# EAGLE design ser2can (EAGLE 6.5.0)
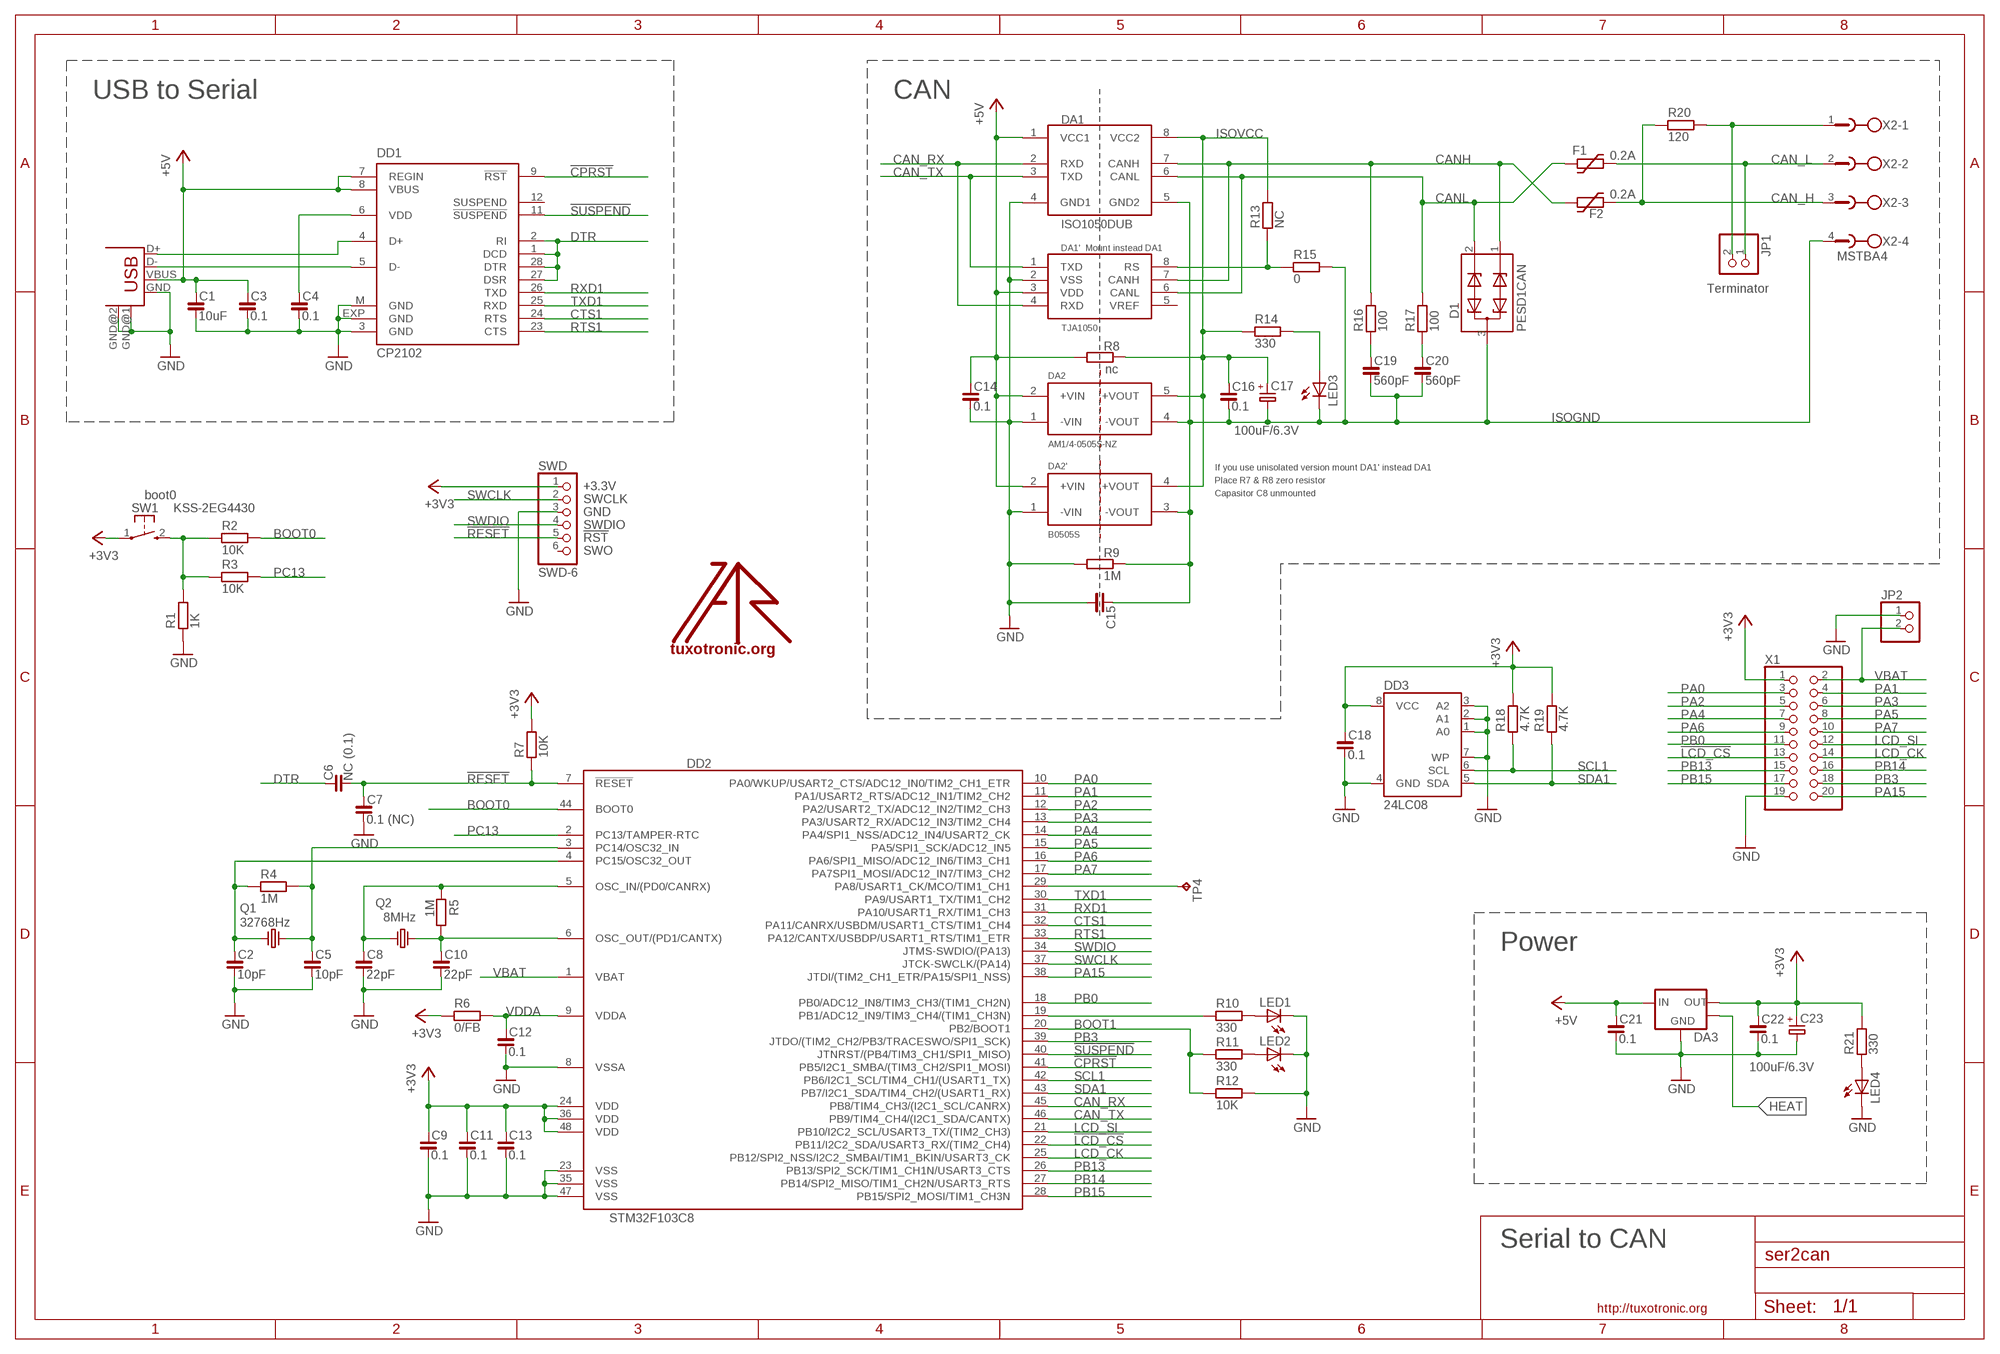
[diagram p0: schematic, sheet 1]

## Parts
C1  10uF  C_0603  [C0603]
C2  10pF  C_0603  [C0603]
C3  0.1  C_0603  [C0603]
C4  0.1  C_0603  [C0603]
C5  10pF  C_0603  [C0603]
C6  NC (0.1)  C_0603  [C0603]
C7  0.1 (NC)  C_0603  [C0603]
C8  22pF  C_0603  [C0603]
C9  0.1  C_0603  [C0603]
C10  22pF  C_0603  [C0603]
C11  0.1  C_0603  [C0603]
C12  0.1  C_0603  [C0603]
C13  0.1  C_0603  [C0603]
C14  0.1  C_0603  [C0603]
C15  C_C050-110X055  [C050-110X055]
C16  0.1  C_0603  [C0603]
C17  100uF/6.3V  CP_SMCC  [SMC_C]
C18  0.1  C_0603  [C0603]
C19  560pF  C_0603  [C0603]
C20  560pF  C_0603  [C0603]
C21  0.1  C_0805  [C0805]
C22  0.1  C_0805  [C0805]
C23  100uF/6.3V  CP_SMCC  [SMC_C]
D1  PESD1CAN  [SOT23]
DA1  ISO1050DUB  [DUB-8]
DA1'  TJA1050  [SO08]
DA2  AM1/4-0505S-NZ  [AM1/4]
DA2'  B0505S  VA-S1  [SIP4]
DA3  LM1117-3.3  [SOT223]
DD1  CP2102  [MLP28]
DD2  STM32F103C8  [LQFP48]
DD3  24LC08  AT24C256S  [SO08]
F1  0.2A  1812L  [1812L]
F2  0.2A  1812L  [1812L]
JP1  PINHD-1X2_2.54S  [1X02SMALL]
JP2  PINHD-1X2_2.00  [1X02M]
LED1  LEDCHIPLED_0805  [CHIPLED_0805]
LED2  LEDCHIPLED_0805  [CHIPLED_0805]
LED3  LEDCHIPLED_0805  [CHIPLED_0805]
LED4  LEDCHIPLED_0805  [CHIPLED_0805]
Q1  32768Hz  CRYSTAL-MM20SS  [MM20SS]
Q2  8MHz  CRYSTAL-HC49S  [HC49/S]
R1  1K  R_0603  [R0603]
R2  10K  R_0603  [R0603]
R3  10K  R_0603  [R0603]
R4  1M  R_0603  [R0603]
R5  1M  R_0603  [R0603]
R6  0/FB  R_0603  [R0603]
R7  10K  R_0603  [R0603]
R8  nc  R_1206  [R1206]
R9  1M  R_1206  [R1206]
R10  330  R_0603  [R0603]
R11  330  R_0603  [R0603]
R12  10K  R_0603  [R0603]
R13  NC  R_0603  [R0603]
R14  330  R_0603  [R0603]
R15  0  R_0603  [R0603]
R16  100  R_0603  [R0603]
R17  100  R_0603  [R0603]
R18  4.7K  R_0603  [R0603]
R19  4.7K  R_0603  [R0603]
R20  120  R_0805  [R0805]
R21  330  R_0603  [R0603]
SW1  KSS-2EG4430  [KSS-2EG4430]
SWD  SWD-6  [JTAG6PIN]
TP4  TPB1,27  [B1,27]
U$  LOGO  [TT_LOGO]
USB1  USB-B-H  [USB-B-H]
X1  PINHD-2X10_2.54  [2X10]
X2  MSTBA4  [MSTBA4]

## Nets
!CPRST: DD1.9(!RST) DD2.41(PB5/I2C1_SMBA/(TIM3_CH2/SPI1_MOSI))
!LCD_CS: DD2.22(PB11/I2C2_SDA/USART3_RX/(TIM2_CH4)) X1.13
!RESET: C6.2 C7.1 DD2.7(!RESET) R7.1 SWD.5
!SUSPEND: DD1.11(!SUSPEND) DD2.40(JTNRST/(PB4/TIM3_CH1/SPI1_MISO))
+3V3: C9.1 C11.1 C13.1 C18.1 C22.1 C23.+ DA3.2(OUT) DD2.24(VDD) DD2.36(VDD) DD2.48(VDD) DD3.8(VCC) R6.1 R7.2 R18.2 R19.2 R21.2 SW1.1(P) SWD.1 X1.1
+5V: C1.1 C3.1 C14.1 C21.1 DA1'.3(VDD) DA1.1(VCC1) DA2'.2(+VIN) DA2.2(+VIN) DA3.3(IN) DD1.7(REGIN) DD1.8(VBUS) R8.1 USB1.VBUS
BOOT0: DD2.44(BOOT0) R2.2
BOOT1: DD2.20(PB2/BOOT1) R11.1 R12.1
CAN_H: F2.P$2 R20.1 X2.3
CAN_L: F1.P$2 JP1.1 X2.2
CAN_L_R: JP1.2 R20.2 X2.1
CAN_RX: DA1'.4(RXD) DA1.2(RXD) DD2.45(PB8/TIM4_CH3/(I2C1_SCL/CANRX))
CAN_TX: DA1'.1(TXD) DA1.3(TXD) DD2.46(PB9/TIM4_CH4/(I2C1_SDA/CANTX))
CANH: D1.1 DA1'.7(CANH) DA1.7(CANH) F2.P$1 R16.2
CANL: D1.2 DA1'.6(CANL) DA1.6(CANL) F1.P$1 R17.2
CTS1: DD1.24(RTS) DD2.32(PA11/CANRX/USBDM/USART1_CTS/TIM1_CH4)
DTR: C6.1 DD1.1(DCD) DD1.2(RI) DD1.27(DSR) DD1.28(DTR)
GND: C1.2 C2.2 C3.2 C4.2 C5.2 C7.2 C8.2 C9.2 C10.2 C11.2 C12.2 C13.2 C14.2 C15.2 C18.2 C21.2 C22.2 C23.- DA1'.2(VSS) DA1.4(GND1) DA2'.1(-VIN) DA2.1(-VIN) DA3.1(GND) DD1.3(GND) DD1.EXP(GND) DD1.M(GND) DD2.8(VSSA) DD2.23(VSS) DD2.35(VSS) DD2.47(VSS) DD3.1(A0) DD3.2(A1) DD3.3(A2) DD3.4(GND) DD3.7(WP) JP2.1 LED1.C LED2.C LED4.C R1.1 R9.1 R12.2 SWD.3 USB1.GND USB1.GND@1(GND) USB1.GND@2(GND) X1.19
HEAT: DA3.4(MASS)
ISOGND: C15.1 C16.2 C17.- C19.2 C20.2 D1.3 DA1.5(GND2) DA2'.3(-VOUT) DA2.4(-VOUT) LED3.C R9.2 R15.2 X2.4
ISOVCC: C16.1 C17.+ DA1.8(VCC2) DA2'.4(+VOUT) DA2.5(+VOUT) R8.2 R13.2 R14.1
LCD_CK: DD2.25(PB12/SPI2_NSS/I2C2_SMBAI/TIM1_BKIN/USART3_CK) X1.14
LCD_SI: DD2.21(PB10/I2C2_SCL/USART3_TX/(TIM2_CH3)) X1.12
N$2: R1.2 R2.1 R3.1 SW1.2(S)
N$3: DD2.29(PA8/USART1_CK/MCO/TIM1_CH1) TP4.PP(TP)
N$4: LED2.A R11.2
N$5: LED1.A R10.2
N$6: LED3.A R14.2
N$7: DD1.5(D-) USB1.D-
N$8: DD1.4(D+) USB1.D+
N$9: LED4.A R21.1
N$10: DD2.19(PB1/ADC12_IN9/TIM3_CH4/(TIM1_CH3N)) R10.1
N$15: DA1'.8(RS) R13.1 R15.1
N$16: C4.1 DD1.6(VDD)
N$54: C20.1 R17.1
N$55: C19.1 R16.1
OSC_IN: C8.1 DD2.5(OSC_IN/(PD0/CANRX)) Q2.1 R5.1
OSC_IN1: C5.1 DD2.3(PC14/OSC32_IN) Q1.4 R4.2
OSC_OUT: C10.1 DD2.6(OSC_OUT/(PD1/CANTX)) Q2.2 R5.2
OSC_OUT1: C2.1 DD2.4(PC15/OSC32_OUT) Q1.1 R4.1
PA0: DD2.10(PA0/WKUP/USART2_CTS/ADC12_IN0/TIM2_CH1_ETR) X1.3
PA1: DD2.11(PA1/USART2_RTS/ADC12_IN1/TIM2_CH2) X1.4
PA2: DD2.12(PA2/USART2_TX/ADC12_IN2/TIM2_CH3) X1.5
PA3: DD2.13(PA3/USART2_RX/ADC12_IN3/TIM2_CH4) X1.6
PA4: DD2.14(PA4/SPI1_NSS/ADC12_IN4/USART2_CK) X1.7
PA5: DD2.15(PA5/SPI1_SCK/ADC12_IN5) X1.8
PA6: DD2.16(PA6/SPI1_MISO/ADC12_IN6/TIM3_CH1) X1.9
PA7: DD2.17(PA7SPI1_MOSI/ADC12_IN7/TIM3_CH2) X1.10
PA15: DD2.38(JTDI/(TIM2_CH1_ETR/PA15/SPI1_NSS)) X1.20
PB0: DD2.18(PB0/ADC12_IN8/TIM3_CH3/(TIM1_CH2N)) X1.11
PB3: DD2.39(JTDO/(TIM2_CH2/PB3/TRACESWO/SPI1_SCK)) X1.18
PB13: DD2.26(PB13/SPI2_SCK/TIM1_CH1N/USART3_CTS) X1.15
PB14: DD2.27(PB14/SPI2_MISO/TIM1_CH2N/USART3_RTS) X1.16
PB15: DD2.28(PB15/SPI2_MOSI/TIM1_CH3N) X1.17
PC13: DD2.2(PC13/TAMPER-RTC) R3.2
RTS1: DD1.23(CTS) DD2.33(PA12/CANTX/USBDP/USART1_RTS/TIM1_ETR)
RXD1: DD1.26(TXD) DD2.31(PA10/USART1_RX/TIM1_CH3)
SCL1: DD2.42(PB6/I2C1_SCL/TIM4_CH1/(USART1_TX)) DD3.6(SCL) R18.1
SDA1: DD2.43(PB7/I2C1_SDA/TIM4_CH2/(USART1_RX)) DD3.5(SDA) R19.1
SWCLK: DD2.37(JTCK-SWCLK/(PA14)) SWD.2
SWDIO: DD2.34(JTMS-SWDIO/(PA13)) SWD.4
TXD1: DD1.25(RXD) DD2.30(PA9/USART1_TX/TIM1_CH2)
VBAT: DD2.1(VBAT) JP2.2 X1.2
VDDA: C12.1 DD2.9(VDDA) R6.2
Unconnected: DA1'.5(VREF) DD1.12(SUSPEND) SWD.6

## Notes on the sheet
- USB to Serial | CAN
- Mount instead DA1
- Terminator
- If you use unisolated version mount DA1' instead DA1
- Place R7 & R8 zero resistor
- boot0 | Capasitor C8 unmounted
- Power
- Serial to CAN

## Library data of the parts
C1-C14 C16 C18-C22 = rc-master-smd:C_: NON-POLARIZED CAP
C15 = rc-master:C_: NON-POLARIZED CAP
C17 C23 = rc-master-smd:CP_: POLARIZED CAP
D1 = protect:PESD1CAN: Features Due to the integrated diode structure only one small SOT23 package is needed to protect two CAN bus lines Max. peak pulse power: PPP = 200 W at tp = 8/20 ?s Low clamping voltage: VCL = 40 V at IPP = 1 A Ultra low leakage current: IRM < 1 nA ESD protection up to 23 kV IEC 61000-4-2, level 4 (ESD) IEC 61000-4-5 (surge); IPP = 3 A at tp = 8/20 ?s Small SMD plastic package Applications CAN bus protection Automotive applications
DA1 = can_driver:ISO1050: ISOLATED CAN TRANSCEIVER
DA1' = can_driver:TJA1050: High speed CAN transceiver Input levels compatible with 3.3 V and 5 V devices 5V supply
DA2 = dcdc-isolated:AM1/4-: AIMTEC: Series AM1/4L-NZ 1/4 Watt | DC-DC Converter RoHS Compliant SMD Package Low ripple and noise High efficiency up to 68% Operating temperature -40oC to + 85oC Input/Output Isolation 1000 and 3000VDC Pin compatible with multiple manufacturers UL94-VO Package
DA2' = dcdc-isolated:VA-****: MOTIEN_DC/DC Single Output Power Converters
DA3 = vreg-linear:LM1117: Linear regulators
DD1 = cp210x-uart:CP210*: Single-Chip USB to UART Bridge Source: www.silabs.com .. CP2101.pdf / cp2102.pdf
DD2 = stm32:STM32F103C
DD3 = stm32-by-pb:AT24C*: 2-wire serial EEPROM
F1 F2 = discrete:1812L
JP1 JP2 = pinhead-fixdrills:PINHD-1X2: PIN HEADER
LED1-LED4 = led:LED: LED OSRAM: - CHIPLED LG R971, LG N971, LY N971, LG Q971, LY Q971, LO R971, LY R971 LH N974, LH R974 LS Q976, LO Q976, LY Q976 LO Q996 - Hyper CHIPLED LW Q18S LB Q993, LB Q99A, LB R99A - SideLED LS A670, LO A670, LY A670, LG A670, LP A670 LB A673, LV A673, LT A673, LW A673 LH A674 LY A675 LS A676, LA A676, LO A676, LY A676, LW A676 LS A679, LY A679, LG A679 - Hyper Micro SIDELED® LS Y876, LA Y876, LO Y876, LY Y876 LT Y87S - SmartLED LW L88C, LW L88S LB L89C, LB L89S, LG L890 LS L89K, LO L89K, LY L89K LS L896, LA L896, LO L896, LY L896 - TOPLED LS T670, LO T670, LY T670, LG T670, LP T670 LSG T670, LSP T670, LSY T670, LOP T670, LYG T670 LG T671, LOG T671, LSG T671 LB T673, LV T673, LT T673, LW T673 LH T674 LS T676, LA T676, LO T676, LY T676, LB T676, LH T676, LSB T676, LW T676 LB T67C, LV T67C, LT T67C, LS T67K, LO T67K, LY T67K, LW E67C LS E67B, LA E67B, LO E67B, LY E67B, LB E67C, LV E67C, LT E67C LW T67C LS T679, LY T679, LG T679 LS T770, LO T770, LY T770, LG T770, LP T770 LB T773, LV T773, LT T773, LW T773 LH T774 LS E675, LA E675, LY E675, LS T675 LS T776, LA T776, LO T776, LY T776, LB T776 LHGB T686 LT T68C, LB T68C - Hyper Mini TOPLED® LB M676 - Mini TOPLED Santana® LG M470 LS M47K, LO M47K, LY M47K Source: http://www.osram.convergy.de - LUMILED® LXK2-PW12-R00, LXK2-PW12-S00, LXK2-PW14-U00, LXK2-PW14-V00 LXK2-PM12-R00, LXK2-PM12-S00, LXK2-PM14-U00 LXK2-PE12-Q00, LXK2-PE12-R00, LXK2-PE12-S00, LXK2-PE14-T00, LXK2-PE14-U00 LXK2-PB12-K00, LXK2-PB12-L00, LXK2-PB12-M00, LXK2-PB14-N00, LXK2-PB14-P00, LXK2-PB14-Q00 LXK2-PR12-L00, LXK2-PR12-M00, LXK2-PR14-Q00, LXK2-PR14-R00 LXK2-PD12-Q00, LXK2-PD12-R00, LXK2-PD12-S00 LXK2-PH12-R00, LXK2-PH12-S00 LXK2-PL12-P00, LXK2-PL12-Q00, LXK2-PL12-R00 Source: www.luxeon.com
Q1 Q2 = discrete:CRYSTAL-: CRYSTAL
R1-R21 = rc-master-smd:R_: RESISTOR
SW1 = buttons:KSS-2EG4430: Size: 3x6mm Height: 5mm from PCB Rating: DC12v 50mA Travel: 0.25±0.10mm Operating Force: 180±50gf Return Force: 60gf min Contact resistance: 100m? max Insulation resistance: 100M? min Operating life?50,000 cycles
SWD = jtag:SWD-6: STM32Fx Discovery
TP4 = testpad:TP: Test pad
U$ = logo:LOGO
USB1 = usb:USB: USB Connectors
X1 = pinhead-fixdrills:PINHD-2X10: PIN HEADER
X2 = con-phoenix-508:MSTBA4: PHOENIX

## Net classes
0 default: width 0.1 mm, drill 0.1 mm, clearance 0.1 mm

## Board
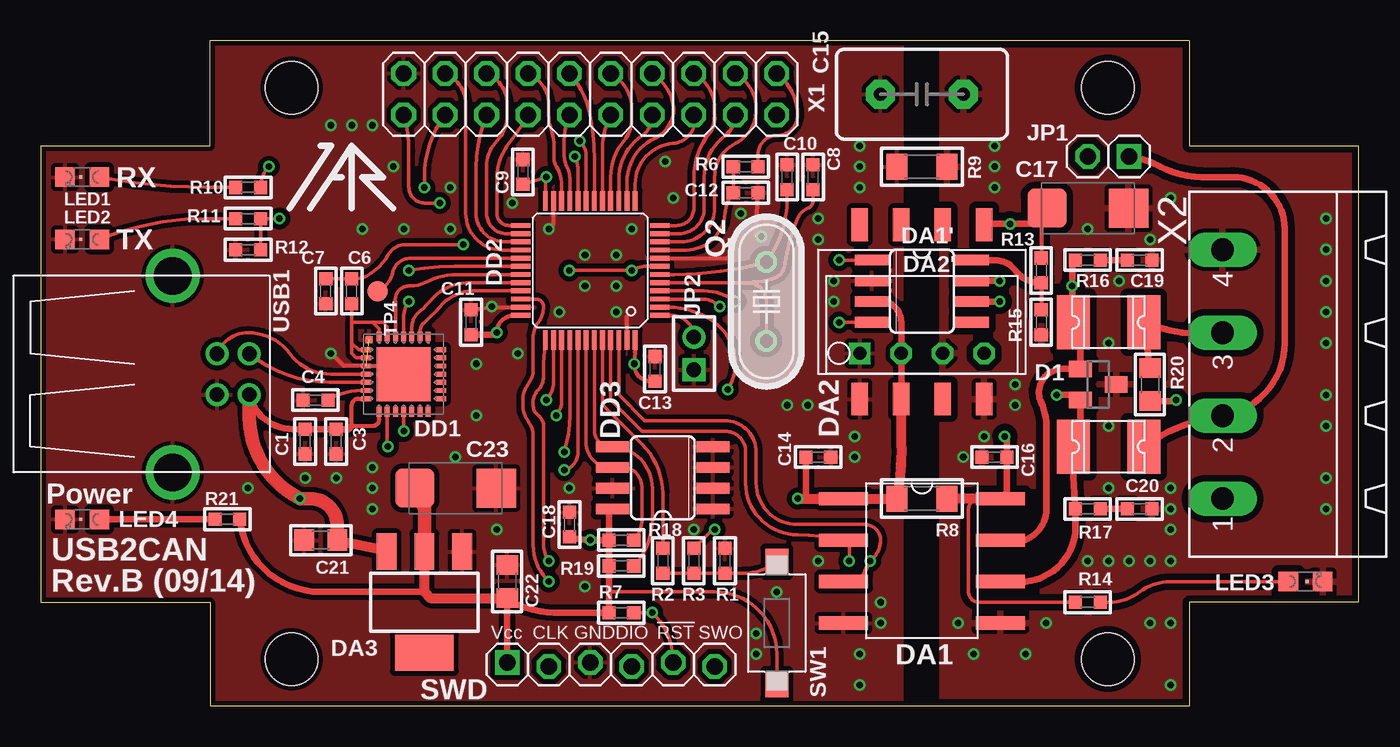
[diagram p1: board, top side]
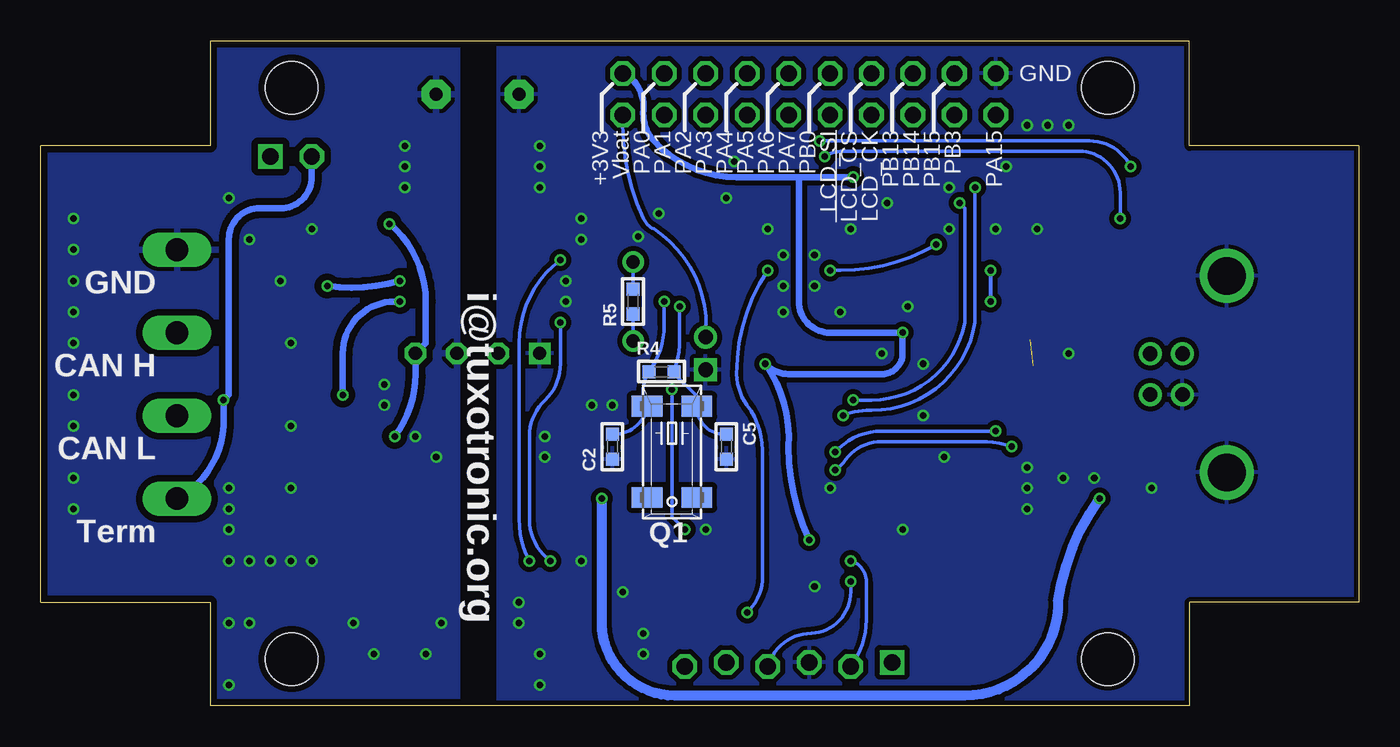
[diagram p2: board, bottom side, seen from below]

Size 80.73 x 40.73 mm. Coordinates in mm from the lower left corner, seen from the top.
Outline: 10.37,0 70.36,0 70.36,6.35 80.73,6.35 80.73,34.29 70.36,34.29 70.36,40.73 10.37,40.73 10.37,34.29 0,34.29 0,6.35 10.37,6.35 10.37,0
Copper layers (1*16): Top 0.035mm / dielectric 1.5mm / Bottom 0.035mm
Design rules "ITEADstudio_DRC": minimum track width 6mil, minimum drill 12mil, track to track 6mil, track to pad 6mil, pad to pad 6mil, via to via 6mil, smd to smd 0mil, copper to edge 10mil, drill to drill 10mil, minimum pad ring 10mil, minimum via ring 6mil, stop-mask expansion 2mil, vias tented up to drill 100mil, thermal gap 10mil
Holes 3.2 mm at 15.37,2.87 65.36,2.87 15.37,37.87 65.36,37.87

### Footprints (pad centres in the part's own frame; a part is rotated, then mirrored left to right if it is on the bottom)
C0603 = smd 0.8 x 0.8: 1 -0.762,0; 2 0.762,0
C050-110X055 = drill 0.8 pad 1.778 octagon: 1 -2.54,0; 2 2.54,0
SMC_C = smd 2.4 x 2.4: + -2.5,0; - 2.5,0
C0805 = smd 1.2 x 1.3: 1 -1.016,0; 2 1.016,0
SOT23 = smd 1 x 1.4: 1 -0.95,-1.1; 2 0.95,-1.1; 3 0,1.1
DUB-8 = smd 0.8 x 3: 1 -3.81,-4.8; 2 -1.27,-4.8; 3 1.27,-4.8; 4 3.81,-4.8; 5 3.81,4.8; 6 1.27,4.8; 7 -1.27,4.8; 8 -3.81,4.8
SO08 = smd 0.66 x 2.032: 1 -1.905,-3.073; 2 -0.635,-3.073; 3 0.635,-3.073; 4 1.905,-3.073; 5 1.905,3.073; 6 0.635,3.073; 7 -0.635,3.073; 8 -1.905,3.073
AM1/4 = smd 1 x 2: 1 -3.81,-5.334; 2 -1.27,-5.334; 3 1.27,-5.334; 4 3.81,-5.334; 5 3.81,5.334; 6 1.27,5.334; 7 -1.27,5.334; 8 -3.81,5.334
SIP4 = drill 0.8 square: 1 0,0 | drill 0.8 octagon: 2 2.54,0; 3 5.08,0; 4 7.62,0
SOT223 = smd 1.219 x 2.235: 1 -2.311,-3.099; 2 0,-3.099; 3 2.311,-3.099 | smd 3.6 x 2.2: 4 0,3.099
MLP28 = smd 0.6 x 0.3: 1 -2.3,1.5; 2 -2.3,1; 3 -2.3,0.5; 4 -2.3,0; 5 -2.3,-0.5; 6 -2.3,-1; 7 -2.3,-1.5; 15 2.3,-1.5; 16 2.3,-1; 17 2.3,-0.5; 18 2.3,0; 19 2.3,0.5; 20 2.3,1; 21 2.3,1.5 | smd 0.3 x 0.6: 8 -1.5,-2.3; 9 -1,-2.3; 10 -0.5,-2.3; 11 0,-2.3; 12 0.5,-2.3; 13 1,-2.3; 14 1.5,-2.3; 22 1.5,2.3; 23 1,2.3; 24 0.5,2.3; 25 0,2.3; 26 -0.5,2.3; 27 -1,2.3; 28 -1.5,2.3 | smd 3.3 x 3.3: EXP 0,0 | smd 0.435 x 0.435: M -2.103,2.103
LQFP48 = smd 0.3 x 1.2: 1 -2.75,-4.25; 2 -2.25,-4.25; 3 -1.75,-4.25; 4 -1.25,-4.25; 5 -0.75,-4.25; 6 -0.25,-4.25; 7 0.25,-4.25; 8 0.75,-4.25; 9 1.25,-4.25; 10 1.75,-4.25; 11 2.25,-4.25; 12 2.75,-4.25; 25 2.75,4.25; 26 2.25,4.25; 27 1.75,4.25; 28 1.25,4.25; 29 0.75,4.25; 30 0.25,4.25; 31 -0.25,4.25; 32 -0.75,4.25; 33 -1.25,4.25; 34 -1.75,4.25; 35 -2.25,4.25; 36 -2.75,4.25 | smd 1.2 x 0.3: 13 4.25,-2.75; 14 4.25,-2.25; 15 4.25,-1.75; 16 4.25,-1.25; 17 4.25,-0.75; 18 4.25,-0.25; 19 4.25,0.25; 20 4.25,0.75; 21 4.25,1.25; 22 4.25,1.75; 23 4.25,2.25; 24 4.25,2.75; 37 -4.25,2.75; 38 -4.25,2.25; 39 -4.25,1.75; 40 -4.25,1.25; 41 -4.25,0.75; 42 -4.25,0.25; 43 -4.25,-0.25; 44 -4.25,-0.75; 45 -4.25,-1.25; 46 -4.25,-1.75; 47 -4.25,-2.25; 48 -4.25,-2.75
1812L = smd 2.03 x 3.3: P$1 -2.16,0; P$2 2.16,0
1X02SMALL = drill 1 square: 1 -1.27,0 | drill 1 octagon: 2 1.27,0
1X02M = drill 0.9 square: 1 -1,0 | drill 0.9: 2 1,0
CHIPLED_0805 = smd 1.2 x 1.2: A 0,-1.05; C 0,1.05
MM20SS = smd 1.27 x 1.88: 1 -2.794,-1.524; 2 2.794,-1.524; 3 2.794,1.524; 4 -2.794,1.524
HC49/S = drill 0.813: 1 -2.413,0; 2 2.413,0
R0603 = smd 0.8 x 0.8: 1 -0.762,0; 2 0.762,0
R1206 = smd 1.3 x 1.6: 1 -1.524,0; 2 1.524,0
R0805 = smd 1.2 x 1.3: 1 -1.016,0; 2 1.016,0
KSS-2EG4430 = smd 1.6 x 1.4: 1 -3.75,0; 2 3.75,0
JTAG6PIN = drill 1 square: 1 -6.35,0.127 | drill 1 octagon: 2 -3.81,-0.127; 3 -1.27,0.127; 4 1.27,-0.127; 5 3.81,0.127; 6 6.35,-0.127
B1,27 = smd 1.27 x 1.27: PP 0,0
USB-B-H = drill 0.9: D+ 0,1.25; D- 1.981,1.25; GND 0,-1.25; VBUS 1.981,-1.25 | drill 2.3: GND@1 -2.718,6.02; GND@2 -2.718,-6.02
2X10 = drill 1 octagon: 1 -11.43,-1.27; 2 -11.43,1.27; 3 -8.89,-1.27; 4 -8.89,1.27; 5 -6.35,-1.27; 6 -6.35,1.27; 7 -3.81,-1.27; 8 -3.81,1.27; 9 -1.27,-1.27; 10 -1.27,1.27; 11 1.27,-1.27; 12 1.27,1.27; 13 3.81,-1.27; 14 3.81,1.27; 15 6.35,-1.27; 16 6.35,1.27; 17 8.89,-1.27; 18 8.89,1.27; 19 11.43,-1.27; 20 11.43,1.27
MSTBA4 = drill 1.4 long: 1 -7.62,5.08; 2 -2.54,5.08; 3 2.54,5.08; 4 7.62,5.08

### Placement (x,y rotation side)
C1  16.19,16.19 270 top
C2  45.72,15.88 270 bottom
C3  18.1,16.19 270 top
C4  16.83,18.73 180 top
C5  38.73,15.88 270 bottom
C6  19.05,25.4 90 top
C7  17.46,25.4 270 top
C8  47.31,32.39 90 top
C9  29.53,32.7 90 top
C10  45.72,32.38 90 top
C11  26.35,23.5 90 top
C12  43.18,31.43 0 top
C13  37.62,20.64 90 top
C14  47.62,15.24 0 top
C15  53.98,37.47 180 top
C16  58.42,15.24 180 top
C17  64.14,30.48 0 top
C18  32.38,11.11 90 top
C19  67.31,27.3 0 top
C20  67.31,12.06 0 top
C21  17.14,10.16 180 top
C22  28.57,7.62 90 top
C23  25.4,13.34 0 top
D1  64.77,19.68 270 top
DA1  53.98,8.89 270 top
DA1'  53.98,25.4 270 top
DA2  53.98,24.13 0 top
DA2'  50.16,21.59 0 top
DA3  23.5,6.35 180 top
DD1  22.23,20.32 0 top
DD2  33.66,26.67 90 top
DD3  38.1,13.97 90 top
F1  65.41,15.88 0 top
F2  65.41,23.5 0 top
JP1  65.41,33.66 180 top
JP2  40.01,21.59 90 top
LED1  2.54,32.38 90 top
LED2  2.54,28.57 90 top
LED3  77.47,7.62 270 top
LED4  2.54,11.43 90 top
Q1  42.07,15.56 270 bottom
Q2  44.45,24.77 90 top
R1  41.91,8.89 270 top
R2  38.1,8.89 90 top
R3  40.01,8.89 90 top
R4  42.7,20.48 0 bottom
R5  44.45,24.77 90 bottom
R6  43.18,33.02 180 top
R7  35.56,5.71 180 top
R8  53.98,12.7 0 top
R9  53.98,33.02 0 top
R10  12.7,31.75 180 top
R11  12.7,29.84 180 top
R12  12.7,27.94 180 top
R13  61.28,26.67 90 top
R14  64.14,6.35 0 top
R15  61.28,23.5 270 top
R16  64.14,27.3 180 top
R17  64.14,12.06 180 top
R18  35.56,10.16 180 top
R19  35.56,8.57 180 top
R20  67.94,19.68 270 top
R21  11.43,11.43 0 top
SW1  45.09,5.08 90 top
SWD  34.92,2.54 0 top
TP4  20.64,25.4 0 top
U$  19.05,33.02 0 top
USB1  10.79,20.32 0 top
X1  33.66,37.47 180 top
X2  77.47,20.32 90 top

### Tracks (layer width: path | path; a pad name or v marks a point on that pad's centre or on a via)
!CPRST  (via drill 0.4)
  Top 0.2: 21.23,15.92 DD1.9 | DD2.41 32.91,15.51 arc-76 v32.07,14.45
  Top 0.254: v21.27,15.88 21.23,15.92
  Bottom 0.2: v21.27,15.88 arc-19 23.18,16.19 29.21,16.19 arc-53 31.43,15.08 arc16 v32.07,14.45
!LCD_CS
  Top 0.2: DD2.22 31.91,31.91 arc32 31.59,33.02 arc-35 31.43,33.66 31.43,34.29 arc19 31.27,35.24 arc-19 31.11,36.2 31.11,36.83 arc67 X1.13
!RESET  (via drill 0.4)
  Top 0.2: DD2.7 37.08,26.92 arc32 v36.2,26.67 v32.38,26.67 | v25.88,28.26 22.38,28.26 arc59 21.27,27.62 arc-29 20,26.35 arc-38 C6.2 C7.1 | SWD.5 arc48 v37.47,5.71 R7.1
  Bottom 0.2: v32.38,26.67 31.75,26.67 arc-30 v25.88,28.26 | v36.2,26.67 arc-34 38.1,20.32 arc-36 37.47,18.41 arc39 36.51,15.24 36.51,7.94 arc46 v37.47,5.71
!SUSPEND  (via drill 0.4)
  Top 0.2: v22.23,16.83 DD1.11 | DD2.40 32.41,17.8 arc-17 v32.07,15.56
  Bottom 0.2: v22.23,16.83 29.21,16.83 arc-48 v32.07,15.56
+3V3  (via drill 0.4)
  Top 0.2: DD2.24 30.91,31.64 arc-8 v30.96,32.38 C9.1 | R6.1 43.94,33.78 arc-90 45.09,34.92 arc90 46.35,36.2 arc53 X1.1 | 34.8,6.99 41.27,6.99 arc-90 45.09,3.17 SW1.1
  Top 0.254: DD2.36 29,23.92 arc90 v27.94,22.86 | DD2.48 36.41,22.02 arc-6 v36.35,20.95 arc55 36.67,20.16 arc48 C13.1
  Top 0.406: R18.2 34.8,11.84 DD3.8 | R18.2 R19.2 34.8,6.99 R7.2 31.43,5.71 arc-35 C22.1 SWD.1 | C11.1 27.75,22.73 v27.94,22.86 | 23.5,6.99 17.14,6.99 arc-84 R21.2 | R18.2 v33.66,10.16 arc-17 C18.1
  Top 0.61: C22.1 23.88,6.6 23.5,6.99 DA3.2
  Top 0.813: DA3.2 23.5,12.11 C23.+
  Bottom 0.406: 34.29,32.38 38.1,32.38 arc47 43.18,34.61 arc49 43.81,36.51 arc-71 X1.1 | 34.29,32.38 34.29,24.77 arc-90 32.38,22.86 v27.94,22.86 27.94,21.59 arc90 29.21,20.32 34.92,20.32 arc48 v36.35,20.95 arc39 34.92,15.88 arc-25 v33.66,10.16 | 34.29,32.38 v30.96,32.38
+5V  (via drill 0.4)
  Top 0.254: DD1.7 19.45,18.82 arc90 19.05,18.41 19.05,17.14 20.32,17.14 arc90 20.73,17.55 DD1.8
  Top 0.406: 47.62,12.7 DA1.1 | 19.05,17.14 18.86,16.95 C3.1 C1.1 15.43,16.95 arc-77 USB1.VBUS | 46.99,15.24 C14.1 46.86,12.73 v46.35,12.7 | DA1'.3 arc-110 52.7,23.5 DA2'.2 DA2.2
  Top 0.61: C21.1 21.11,9.53 DA3.3 | v46.35,12.7 47.62,12.7 | DA2.2 52.7,15.88 arc-9 R8.1 DA1.1
  Top 0.813: USB1.VBUS 12.78,17.7 arc64 v15.88,12.7 16.51,12.7 arc-90 18.16,11.05 C21.1
  Bottom 0.61: v46.35,12.7 46.35,5.08 arc-90 41.91,0.64 24.13,0.64 arc-90 18.41,6.35 arc28 v15.88,12.7
BOOT0
  Top 0.2: DD2.44 34.41,18.46 36.83,16.03 arc-44 38.1,13.02 R2.2
BOOT1  (via drill 0.4)
  Top 0.2: DD2.20 32.91,32.82 arc27 v32.7,33.66 | R12.1 R11.1 v14.61,29.84
  Bottom 0.2: v32.7,33.66 arc32 31.59,33.97 17.14,33.97 arc90 14.61,31.43 v14.61,29.84
CAN_H
  Top 0.406: X2.3 arc-29 F2.P$2 R20.1
CAN_L
  Top 0.406: F1.P$2 arc-29 X2.2 arc81 76.2,22.23 76.2,29.21 arc90 73.03,32.38 71.12,32.38 arc-28 68.58,33.02 arc19 JP1.1
CAN_L_R  (via drill 0.4)
  Top 0.406: R20.2 69.47,18.67 v69.53,18.73
  Bottom 0.406: X2.1 arc-59 69.53,17.14 v69.53,18.73 69.22,19.05 69.22,28.57 arc90 67.31,30.48 66.04,30.48 arc-90 64.14,32.38 JP1.2
CAN_RX  (via drill 0.4)
  Top 0.2: DD2.45 34.91,18.75 36.83,16.83 41.91,16.83 arc-90 43.18,15.56 43.18,13.65 arc90 46.35,10.48 arc-13 DA1.2 49.53,9.8 v49.53,8.89 | v48.9,23.5 DA1'.4
  Top 0.254: DA1.2 49.21,10.12
  Bottom 0.2: v49.53,8.89 arc53 50.8,11.43 50.8,16.51 arc46 49.85,18.73 arc-46 48.9,20.95 v48.9,23.5
CAN_TX  (via drill 0.4)
  Top 0.2: DD2.46 35.41,19.05 36.99,17.46 41.91,17.46 arc-90 43.81,15.56 43.81,13.65 arc90 46.35,11.11 50.48,11.11 arc-90 51.44,10.16 arc-53 v50.8,8.89 | v48.9,27.3 DA1'.1
  Top 0.254: DA1.3 50.16,7.62 v50.8,8.89
  Bottom 0.2: v50.8,8.89 arc28 51.44,11.43 51.44,22.23 arc53 v48.9,27.3
CANH  (via drill 0.4)
  Top 0.406: v58.74,26.04 DA1'.7 | R16.2 63.18,27.11 v63.18,25.72 63.18,24.45 63.24,24.39 F2.P$1 63.67,23.07 D1.1 arc4 62.55,20.64 arc113 61.28,18.57 arc-25 61.59,17.14 61.59,12.06 arc-112 DA1.7
  Bottom 0.406: v63.18,25.72 arc-24 v58.74,26.04
CANL  (via drill 0.4)
  Top 0.406: 59.69,7.62 DA1.6 60.33,7.62 arc90 63.37,11.3 R17.2 arc-5 63.24,14.98 F1.P$1 63.67,16.3 D1.2 63.35,19.05 v62.23,19.05 | v58.74,24.77 DA1'.6
  Bottom 0.406: v58.74,24.77 59.05,24.77 arc-90 62.23,21.59 v62.23,19.05
CTS1
  Top 0.2: DD1.24 22.73,23.18 arc-51 23.18,24.13 arc12 23.81,24.77 arc-53 26.35,25.92 DD2.32
DTR
  Top 0.2: DD1.1 19.45,21.82 19.05,22.23 | 19.05,22.23 19.05,23.5 | 19.05,23.5 20.32,23.5 | DD1.28 20.73,23.09 20.32,23.5 | DD1.27 21.23,23.23 20.95,23.5 20.32,23.5 | DD1.2 19.32,21.32 19.05,21.59 19.05,22.23 | C6.1 19.05,23.5
GND  (via drill 0.4)  (1 unrouted)
  Top 0.254: v17.78,21.59 18.55,20.82 DD1.3 21.73,20.82 DD1.EXP | DD2.47 35.91,23.84 | DD2.23 31.41,29.5 v31.11,29.21 | DD2.35 27.46,24.42 C11.2 | DD2.8 42.02,27.42 | 43.81,28.77 C12.2
  other vias: 46.99,18.41 49.85,15.24 32.38,13.34 33.34,7.3 27.62,24.45 43.81,3.17 50.16,1.27 36.2,29.21 31.75,24.13 35.24,25.72 25.08,29.21 38.26,33.34 38.73,31.11 50.16,34.29 18.1,13.97 12.7,13.34 25.4,15.24 27.94,10.79 40.01,10.79 50.16,33.02 50.16,31.75 49.85,16.51 48.58,26.04 26.67,17.78 16.19,13.97 20.32,13.34 20.32,14.61 20.32,12.06 29.21,21.59 19.68,29.21 25.08,31.75 22.23,29.21 48.58,24.77 28.89,30.8 35.24,24.13 33.34,27.62 33.34,25.72 35.24,27.62 51.44,5.08 51.44,6.35 50.16,3.17 47.62,8.89 42.86,30.16 44.13,28.73 45.72,18.41 21.59,33.02 26.67,20.95 20.32,35.56 19.05,35.56 17.78,35.56 47.62,29.84 47.62,28.57 45.09,6.99 43.81,4.45
  pour Top (isolate 0.305, rank 5): -1.91,41.91 52.7,41.91 52.7,-1.27 -1.91,-1.27
  pour Bottom (isolate 0.305, rank 5): -1.27,41.27 52.7,41.27 52.7,-0.64 -1.27,-0.64
ISOGND  (via drill 0.4)
  other vias: 59.69,18.41 59.69,19.68 56.2,5.08 65.41,22.23 57.78,16.51 69.22,1.27 67.94,5.08 69.22,5.08 69.22,8.89 67.94,8.89 66.67,8.89 65.41,8.89 64.14,8.89 69.22,12.06 69.22,13.34 66.04,26.04 65.41,13.34 58.42,33.02 58.42,34.29 58.42,31.75 61.59,5.08 60.33,3.17 57.15,3.17 69.22,31.11 78.74,29.84 78.74,27.94 78.74,26.04 78.74,24.13 78.74,22.23 78.74,12.06 78.74,13.97 78.74,19.05 78.74,17.14 64.14,29.21 67.94,28.57 69.22,10.79 65.41,17.14 56.52,15.24
  pour Top (isolate 0.406, rank 4): 55.24,42.55 83.82,42.55 83.82,-1.27 55.24,-1.27
  pour Bottom (isolate 0.406, rank 4): 55.24,41.91 83.19,41.91 83.19,-0.64 55.24,-0.64
ISOVCC  (via drill 0.4)
  Top 0.2: R14.1 57.47,6.35 arc-90 56.83,6.99 56.83,12.06 arc-90 57.47,12.7
  Top 0.254: 57.47,12.7 DA1.8 | R13.2 61.28,30.76 C17.+
  Top 0.406: DA1.8 59.18,13.11 C16.1 59.18,16.38 v59.05,16.51 | 58.08,29.46 DA2.5 57.85,29.53 v59.37,29.53 60.68,29.53 C17.+
  Top 0.61: DA1.8 R8.2
  Bottom 0.406: v59.05,16.51 arc-37 57.78,20.32 DA2'.4 57.15,22.23 57.15,24.77 arc-50 v59.37,29.53
LCD_CK
  Top 0.2: DD2.25 28.68,29.42 arc-90 27.94,30.16 27.94,32.38 arc-37 28.57,34.29 arc6 X1.14
LCD_SI
  Top 0.2: DD2.21 32.41,32.21 arc31 32.23,33.02 arc-28 32.07,33.66 32.07,34.61 arc-23 X1.12
N$2
  Top 0.2: R2.1 R3.1 R1.2 43.05,8.13 arc38 SW1.2
N$3
  Top 0.2: DD2.29 22.66,27.42 arc70 21.59,26.67 arc-56 TP4.PP
N$4
  Top 0.2: R11.2 10.16,29.84 arc22 LED2.A
N$5
  Top 0.2: R10.2 10.16,31.75 arc-11 LED1.A
N$6
  Top 0.2: LED3.A 69.22,7.62 arc37 67.31,6.99 arc-37 65.41,6.35 R14.2
N$7
  Top 0.2: DD1.5 17.7,19.82 arc-39 USB1.D-
N$8
  Top 0.2: DD1.4 17.78,20.32 arc-53 15.24,21.59 arc53 12.7,22.86 arc68 USB1.D+
N$9
  Top 0.406: LED4.A R21.1
N$10  (via drill 0.4)
  Top 0.2: DD2.19 33.41,33.66 arc44 v33.02,34.61 | v13.97,33.02 arc46 R10.1
  Bottom 0.2: v33.02,34.61 16.51,34.61 arc64 v13.97,33.02
N$15
  Top 0.254: R13.1 R15.1
  Top 0.406: DA1'.8 58.42,27.3 arc-53 59.69,26.67 arc55 R13.1
N$16
  Top 0.2: C4.1 arc-32 19.64,19.32
  Top 0.254: 19.64,19.32 DD1.6
N$54
  Top 0.406: R17.1 C20.1
N$55
  Top 0.406: R16.1 C19.1
OSC_IN
  Top 0.2: DD2.5 43.3,25.92 | C8.1 47.31,30.96 arc-67 46.99,30.48 arc45 46.35,29.84 arc14 45.56,26.99 arc-65 44.93,26.19 arc-19 43.3,25.92 | Q2.1 44.45,24.77 arc90 43.3,25.92
  Bottom 0.2: Q2.1 R5.1
OSC_IN1  (via drill 0.4)
  Top 0.2: DD2.3 40.48,24.92 arc-46 v41.59,24.45
  Bottom 0.2: v41.59,24.45 41.59,22.51 arc20 R4.2 | 38.86,16.64 arc91 Q1.4 | 41.94,20.35 40.55,18.95
  Bottom 0.254: C5.1 38.86,16.64 | R4.2 41.94,20.35 | Q1.4 40.55,18.95
OSC_OUT
  Top 0.2: DD2.6 38.79,26.42 arc15 Q2.2 arc36 45.72,31.11 C10.1
  Bottom 0.2: Q2.2 R5.2
OSC_OUT1  (via drill 0.4)
  Top 0.2: DD2.4 40.62,25.42 arc-38 v42.55,24.77
  Bottom 0.2: v42.55,24.77 42.55,23.3 arc36 R4.1 arc-65 Q1.1 arc81 45.59,16.64
  Bottom 0.254: 45.59,16.64 C2.1
PA0
  Top 0.2: DD2.10 39.22,28.42 arc90 41.27,30.48 41.27,32.38 arc-63 42.55,34.45 arc59 43.81,36.35 43.81,36.83 arc53 X1.3
PA1
  Top 0.2: DD2.11 39.08,28.92 arc90 40.64,30.48 40.64,32.38 arc-53 41.91,34.92
  Top 0.254: 41.91,34.92 arc53 X1.4
PA2
  Top 0.2: DD2.12 38.95,29.42 arc90 40.01,30.48 40.01,32.38 arc-39 40.96,35.08 | X1.5 arc-53 41.27,36.83 41.27,36.04
  Top 0.254: 40.96,35.08 arc41 41.27,36.04
PA3
  Top 0.2: DD2.13 36.41,31.96 arc-86 38.73,34.45 arc100 X1.6
PA4
  Top 0.2: DD2.14 35.91,32.09 arc-66 37.62,34.77 arc74 38.73,36.83 arc46 X1.7
PA5
  Top 0.2: DD2.15 35.41,32.23 arc-56 36.83,34.92 arc58 X1.8
PA6
  Top 0.2: DD2.16 34.91,32.37 arc-40 35.72,34.61 arc43 36.2,36.04 36.2,36.83 arc52 X1.9
PA7
  Top 0.2: DD2.17 34.41,34.41 arc-24 X1.10
PA15  (via drill 0.4)
  Top 0.2: DD2.38 31.41,19.82 arc-45 v30.96,18.73 | v24.45,30.8 23.5,30.8 arc-90 22.54,31.75 22.54,33.97 arc16 X1.20
  Bottom 0.2: v30.96,18.73 29.84,18.73 arc-80 24.13,23.5 24.13,30.48 v24.45,30.8
PB0
  Top 0.2: DD2.18 33.91,33.41 arc10 33.66,36.2 arc33 X1.11
PB3  (via drill 0.4)
  Top 0.2: DD2.39 31.91,18.73 arc-37 v31.59,17.78 | v23.5,31.75 23.5,32.38 arc-37 X1.18
  Bottom 0.2: v23.5,31.75 23.5,23.5 arc81 29.84,18.1 30.16,18.1 arc-25 v31.59,17.78
PB13
  Top 0.2: DD2.26 28.55,28.92 arc-90 27.3,30.16 27.3,33.02 arc-44 27.94,34.61 arc44 28.57,36.2 28.57,36.83 arc67 X1.15
PB14
  Top 0.2: DD2.27 28.41,28.42 arc-90 26.67,30.16 26.67,33.02 arc-23 X1.16
PB15
  Top 0.2: DD2.28 28.28,27.92 arc-90 26.04,30.16 26.04,36.83 arc67 X1.17
PC13  (via drill 0.4)
  Top 0.2: v41.27,10.79 41.15,10.79 R3.2 | 38.45,24.42 arc-36 41.27,23.5 arc-54 42.55,20.95 arc-32 v42.07,19.37
  Top 0.254: DD2.2 38.45,24.42
  Bottom 0.2: v42.07,19.37 42.07,11.59 v41.27,10.79
RTS1
  Top 0.2: DD1.23 23.23,22.91 arc-49 23.5,23.5 arc9 24.45,24.45 arc-52 26.69,25.42 DD2.33
RXD1
  Top 0.2: DD1.26 21.73,24.77 arc-99 22.54,25.72 22.86,25.72 arc16 23.81,26.04 arc-26 25.47,26.42 DD2.31
SCL1
  Top 0.2: DD2.42 33.41,16.12 arc94 DD3.6 arc-110 36.83,13.34 36.83,11.43 arc-44 R18.1
SDA1
  Top 0.2: DD2.43 33.91,16.89 arc95 DD3.5 arc-88 37.47,13.34 37.47,11.43 arc-44 R19.1
SWCLK  (via drill 0.4)
  Top 0.2: DD2.37 arc6 30.8,20.32 30.8,20.16 arc-44 30.48,19.37 arc34 30.16,18.73 30.16,18.41 arc53 30.48,17.78 arc-53 30.8,17.14 30.8,9.84 30.8,9.84 arc37 v31.11,8.89
  Bottom 0.2: SWD.2 arc-37 30.16,5.27 30.16,7.62 arc-74 v31.11,8.89
SWDIO  (via drill 0.4)
  Top 0.2: DD2.34 30.32,24.92 arc-90 30.8,24.45 arc-37 30.48,23.5 arc37 30.16,22.54 30.16,20.64 arc-37 29.84,19.68 arc37 29.53,18.73 29.53,18.41 arc37 29.84,17.46 arc-37 30.16,16.51 30.16,9.84 arc46 v31.11,7.62
  Bottom 0.2: v31.11,7.62 31.11,6.99 arc87 33.53,4.45 arc-75 SWD.4
TXD1  (via drill 0.4)
  Top 0.2: DD1.25 22.23,23.81 arc-37 v22.54,24.77 | DD2.30 25.33,26.92 arc10 v22.54,26.67
  Bottom 0.254: v22.54,24.77 v22.54,26.67
VBAT
  Top 0.2: 38.63,23.92 arc-88 JP2.2
  Top 0.254: DD2.1 38.63,23.92
  Bottom 0.2: X1.2 45.09,35.56 arc-25 43.81,29.84 arc-40 43.18,29.21 arc63 JP2.2
VDDA
  Top 0.2: DD2.9 39.54,27.92 arc87 41.91,30.16 arc-37 C12.1 R6.2

### Text on the board
tPlace: RX | TX | Power | USB2CAN | Rev.B (09/14)
bPlace: GND | PA15 | PB3 | PB15 | PB14 | PB13 | LCD_CK | !LCD_CS | LCD_SI | PB0 | PA7 | PA6 | PA5 | PA4 | PA3 | PA2 | PA1 | PA0 | Vbat | +3V3 | GND | i@tuxotronic.org | CAN H | CAN L | Term